# EAGLE schematic Transmitter (EAGLE 7.2.0)
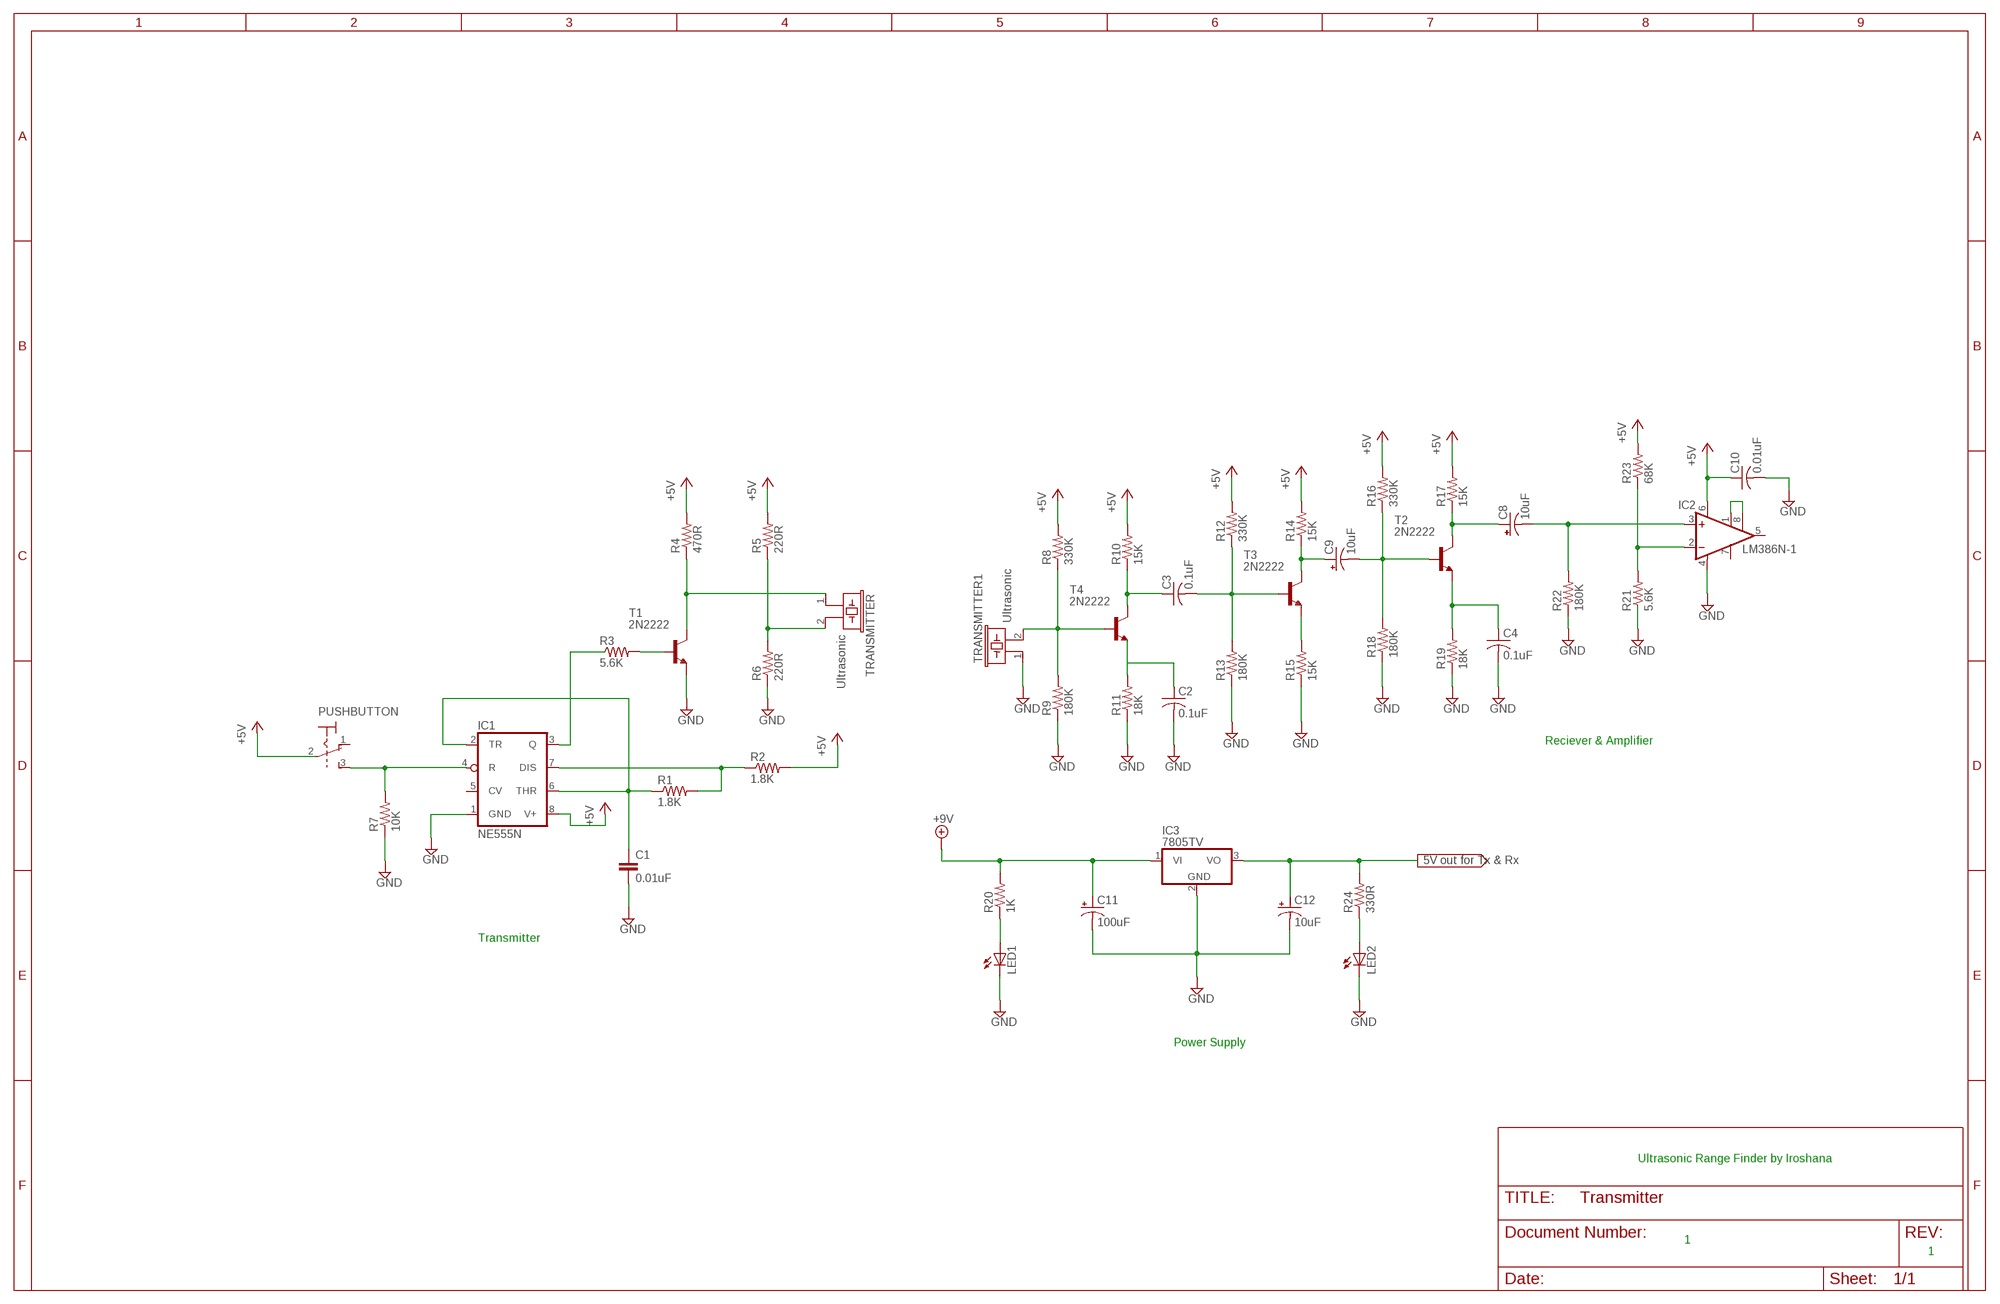
[diagram p0: schematic, sheet 1]

## Parts
C1  0.01uF  C2.5/2  [C2.5-2]
C2  0.1uF  C-US025-025X050  [C025-025X050]
C3  0.1uF  C-US025-025X050  [C025-025X050]
C4  0.1uF  C-US025-025X050  [C025-025X050]
C8  10uF  CPOL-USE2.5-6  [E2,5-6]
C9  10uF  CPOL-USE2.5-6  [E2,5-6]
C10  0.01uF  C-US025-025X050  [C025-025X050]
C11  100uF  CPOL-USE2.5-6  [E2,5-6]
C12  10uF  CPOL-USE2.5-6  [E2,5-6]
IC1  NE555N  [DIL08-ROUND]
IC2  LM386N-1  [DIL08]
IC3  7805TV  [TO220V]
LED1  LED5MM  [LED5MM]
LED2  LED5MM  [LED5MM]
PUSHBUTTON  M9040P2  [M9040P2]
R1  1.8K  R-US_0207/10  [0207/10]
R2  1.8K  R-US_0207/10  [0207/10]
R3  5.6K  R-US_0207/10  [0207/10]
R4  470R  R-US_0207/10  [0207/10]
R5  220R  R-US_0207/10  [0207/10]
R6  220R  R-US_0207/10  [0207/10]
R7  10K  R-US_0207/10  [0207/10]
R8  330K  R-US_0207/10  [0207/10]
R9  180K  R-US_0207/10  [0207/10]
R10  15K  R-US_0207/10  [0207/10]
R11  18K  R-US_0207/10  [0207/10]
R12  330K  R-US_0207/10  [0207/10]
R13  180K  R-US_0207/10  [0207/10]
R14  15K  R-US_0207/10  [0207/10]
R15  15K  R-US_0207/10  [0207/10]
R16  330K  R-US_0207/10  [0207/10]
R17  15K  R-US_0207/10  [0207/10]
R18  180K  R-US_0207/10  [0207/10]
R19  18K  R-US_0207/10  [0207/10]
R20  1K  R-US_0207/10  [0207/10]
R21  5.6K  R-US_0207/10  [0207/10]
R22  180K  R-US_0207/10  [0207/10]
R23  68K  R-US_0207/10  [0207/10]
R24  330R  R-US_0207/10  [0207/10]
T1  2N2222  [TO92-EBC-OVAL]
T2  2N2222  [TO92-EBC-OVAL]
T3  2N2222  [TO92-EBC-OVAL]
T4  2N2222  [TO92-EBC-OVAL]
TRANSMITTER  Ultrasonic  EFBRD22C41  [EFBRD22C41]
TRANSMITTER1  Ultrasonic  EFBRD22C41  [EFBRD22C41]

## Nets
+5V: C10.1 IC1.8(V+) IC2.6(VS) R2.2 R4.2 R5.2 R8.2 R10.2 R12.2 R14.2 R16.2 R17.2 R23.2
+9V: C11.+ IC3.1(VI) R20.2
CONN: C1.1 IC1.2(TR) IC1.6(THR) R1.1
GND: C1.2 C2.2 C4.2 C10.2 C11.- C12.- IC1.1(GND) IC2.4(GND) IC3.2(GND) LED1.K(C) LED2.K(C) R6.1 R7.1 R9.1 R11.1 R13.1 R15.1 R18.1 R19.1 R22.1 T1.E TRANSMITTER1.1
N$1: IC1.3(Q)
N$2: R3.2 T1.B
N$3: R4.1 T1.C TRANSMITTER.1
N$4: R5.1 R6.2 TRANSMITTER.2
N$5: IC1.4(R) PUSHBUTTON.3(1:S) R7.2
N$6: R8.1 R9.2 T4.B TRANSMITTER1.2
N$8: C2.1 R11.2
N$9: C3.2 R12.1 R13.2 T3.B
N$10: IC1.7(DIS) R1.2 R2.1
N$11: C9.+ R14.1 T3.C
N$12: R15.2 T3.E
N$13: C9.- R16.1 R18.2 T2.B
N$14: C4.1 R19.2 T2.E
N$15: C8.+ R17.1 T2.C
N$16: C8.- IC2.3(+IN) R22.2
N$17: IC2.2(-IN) R21.2 R23.1
N$18: IC2.1(GAIN) IC2.8(GAIN)
N$19: C3.1 R10.1 T4.C
N$20: C12.+ IC3.3(VO) R24.2
N$21: LED1.A R20.1
N$22: LED2.A R24.1
Unconnected: IC1.5(CV) IC2.5(OUT) IC2.7(BYPASS) PUSHBUTTON.1(1:O) PUSHBUTTON.2(1:P) PUSHBUTTON.4(2:O) PUSHBUTTON.5(2:P) PUSHBUTTON.6(2:S) R3.1 R21.1 T4.E

## Notes on the sheet
- Reciever & Amplifier
- Transmitter
- Power Supply
- Ultrasonic Range Finder by Iroshana
- 1
- 1

## Library data of the parts
C1 = capacitor-wima:C: CAPACITOR naming: grid - package width
C2-C4 C10 = adafruit:C-US: CAPACITOR, American symbol
C8 C9 C11 C12 = adafruit:CPOL-US: POLARIZED CAPACITOR, American symbol
IC1 = adafruit:*555: TIMER Changed DIP package to have round (not oval) pin pads http://www.ladyada.net/library/pcb/eaglelibrary.html
IC2 = linear:LM386?-*: Low Voltage Audio Power Amplifier Source: http://cache.national.com/ds/LM/LM386.pdf
IC3 = linear:78*: Positive VOLTAGE REGULATOR Source: http://cache.national.com/ds/LM/LM78L05.pdf http://www.fairchildsemi.com/ds/LM/LM7805.pdf
LED1 LED2 = adafruit:LED: LED OSRAM: - CHIPLED LG R971, LG N971, LY N971, LG Q971, LY Q971, LO R971, LY R971 LH N974, LH R974 LS Q976, LO Q976, LY Q976 LO Q996 - Hyper CHIPLED LW Q18S LB Q993, LB Q99A, LB R99A - SideLED LS A670, LO A670, LY A670, LG A670, LP A670 LB A673, LV A673, LT A673, LW A673 LH A674 LY A675 LS A676, LA A676, LO A676, LY A676, LW A676 LS A679, LY A679, LG A679 - Hyper Micro SIDELED® LS Y876, LA Y876, LO Y876, LY Y876 LT Y87S - SmartLED LW L88C, LW L88S LB L89C, LB L89S, LG L890 LS L89K, LO L89K, LY L89K LS L896, LA L896, LO L896, LY L896 - TOPLED LS T670, LO T670, LY T670, LG T670, LP T670 LSG T670, LSP T670, LSY T670, LOP T670, LYG T670 LG T671, LOG T671, LSG T671 LB T673, LV T673, LT T673, LW T673 LH T674 LS T676, LA T676, LO T676, LY T676, LB T676, LH T676, LSB T676, LW T676 LB T67C, LV T67C, LT T67C, LS T67K, LO T67K, LY T67K, LW E67C LS E67B, LA E67B, LO E67B, LY E67B, LB E67C, LV E67C, LT E67C LW T67C LS T679, LY T679, LG T679 LS T770, LO T770, LY T770, LG T770, LP T770 LB T773, LV T773, LT T773, LW T773 LH T774 LS E675, LA E675, LY E675, LS T675 LS T776, LA T776, LO T776, LY T776, LB T776 LHGB T686 LT T68C, LB T68C - Hyper Mini TOPLED® LB M676 - Mini TOPLED Santana® LG M470 LS M47K, LO M47K, LY M47K Source: http://www.osram.convergy.de/
PUSHBUTTON = switch:M9040P2: TOGGLE SWITCH Marquardt
R1-R7 = resistor:R-US_: RESISTOR, American symbol
R8-R24 = adafruit:R-US_: RESISTOR, American symbol
T1-T4 = adafruit:2N2222: NPN TRANSISTOR Big oval pads
TRANSMITTER TRANSMITTER1 = buzzer:EFB?: Piezoelectric Acoustic Transducer Source: Panbasonic .. 2SC1685.pdf; OC_FARNELL: unknown; OC_NEWARK: unknown